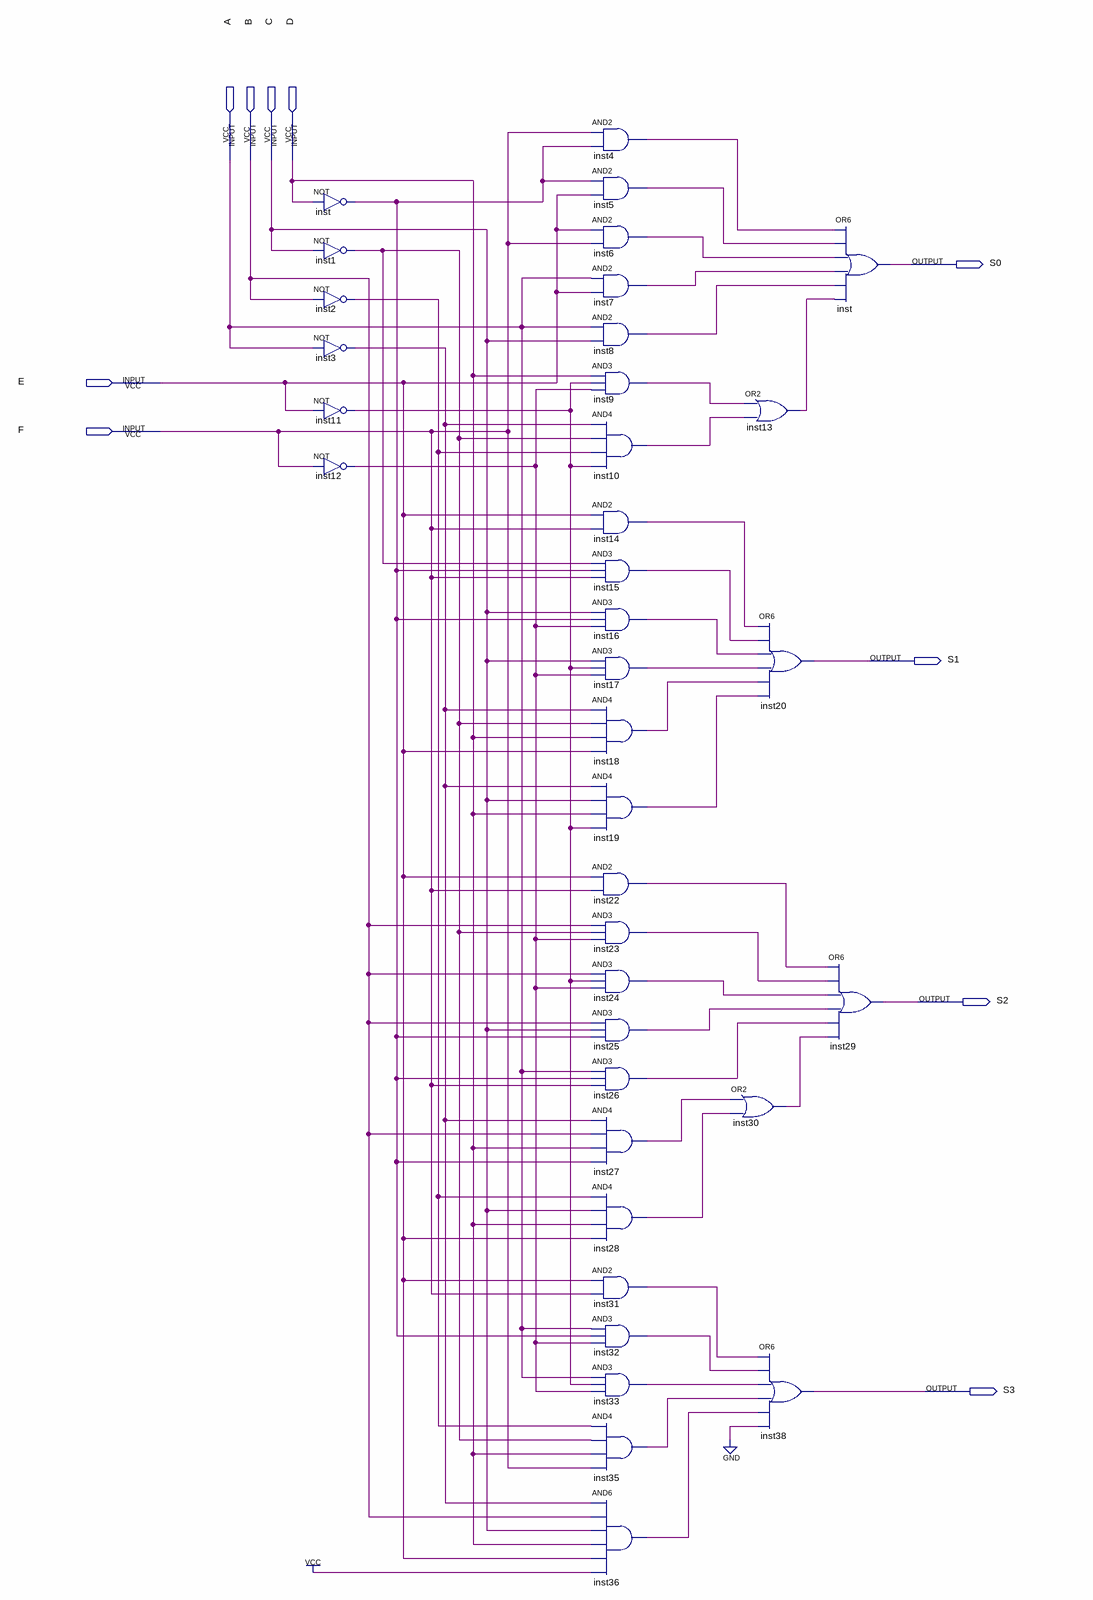
[diagram p0: schematic sheet]
// Quartus schematic s0.bdf as structural Verilog: 37 symbols, 10 pins
module s0 (
  input  A,
  input  B,
  input  C,
  input  D,
  input  E,
  input  F,
  output S0,
  output S1,
  output S2,
  output S3
);

  wire inst1_out, inst2_out, inst3_out, inst4_out, inst5_out, inst6_out, inst7_out, inst8_out, inst9_out,
       inst10_out, inst11_out, inst12_out, inst13_out, inst14_out, inst15_out, inst16_out, inst17_out,
       inst18_out, inst19_out, inst22_out, inst23_out, inst24_out, inst25_out, inst26_out, inst27_out,
       inst28_out, inst30_out, inst31_out, inst32_out, inst33_out, inst35_out, inst36_out, inst_out;

  not inst (inst_out, D);
  not inst1 (inst1_out, C);
  not inst2 (inst2_out, B);
  not inst3 (inst3_out, A);
  not inst11 (inst11_out, E);
  not inst12 (inst12_out, F);
  and inst4 (inst4_out, F, inst_out);
  and inst5 (inst5_out, inst_out, E);
  and inst6 (inst6_out, E, F);
  and inst7 (inst7_out, A, E);
  and inst8 (inst8_out, A, C);
  and inst9 (inst9_out, D, inst11_out, inst12_out);
  and inst10 (inst10_out, inst3_out, inst1_out, inst2_out, inst11_out);
  and inst14 (inst14_out, E, F);
  and inst15 (inst15_out, inst1_out, inst_out, F);
  and inst16 (inst16_out, C, inst_out, inst12_out);
  and inst17 (inst17_out, C, inst11_out, inst12_out);
  and inst18 (inst18_out, inst3_out, inst1_out, D, E);
  and inst19 (inst19_out, inst3_out, C, D, inst11_out);
  and inst22 (inst22_out, E, F);
  and inst23 (inst23_out, B, inst1_out, inst12_out);
  and inst24 (inst24_out, B, inst11_out, inst12_out);
  and inst25 (inst25_out, B, C, inst_out);
  and inst26 (inst26_out, A, inst_out, F);
  and inst27 (inst27_out, inst3_out, B, D, inst_out);
  and inst28 (inst28_out, inst2_out, C, D, E);
  and inst31 (inst31_out, E, F);
  and inst32 (inst32_out, A, inst_out, inst12_out);
  and inst33 (inst33_out, A, inst11_out, inst12_out);
  and inst35 (inst35_out, inst2_out, inst1_out, D, F);
  and inst36 (inst36_out, inst3_out, B, C, D, E, 1'b1);
  or inst13 (inst13_out, inst9_out, inst10_out);
  or inst20 (S1, inst14_out, inst15_out, inst16_out, inst17_out, inst18_out, inst19_out);
  or inst30 (inst30_out, inst27_out, inst28_out);
  or inst38 (S3, inst31_out, inst32_out, inst33_out, inst35_out, inst36_out, 1'b0);
  or inst_dup2 (S0, inst4_out, inst5_out, inst6_out, inst7_out, inst8_out, inst13_out);
  or inst29 (S2, inst22_out, inst23_out, inst24_out, inst25_out, inst26_out, inst30_out);
endmodule
